# EasyEDA Pro project my_supercap_1.eprj, board 下板
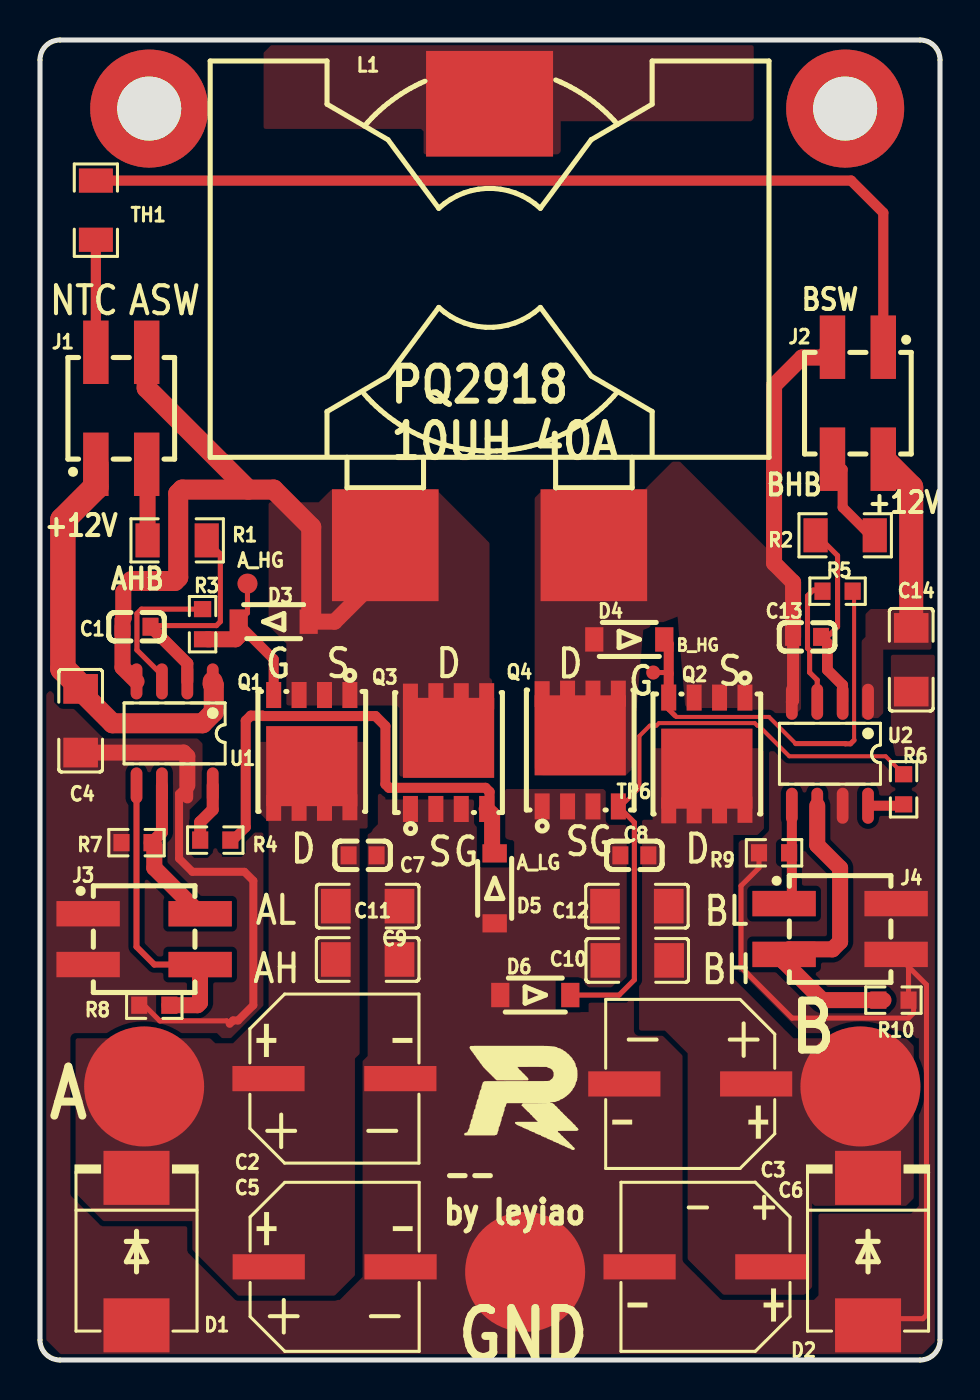
[diagram p10: board, top side]
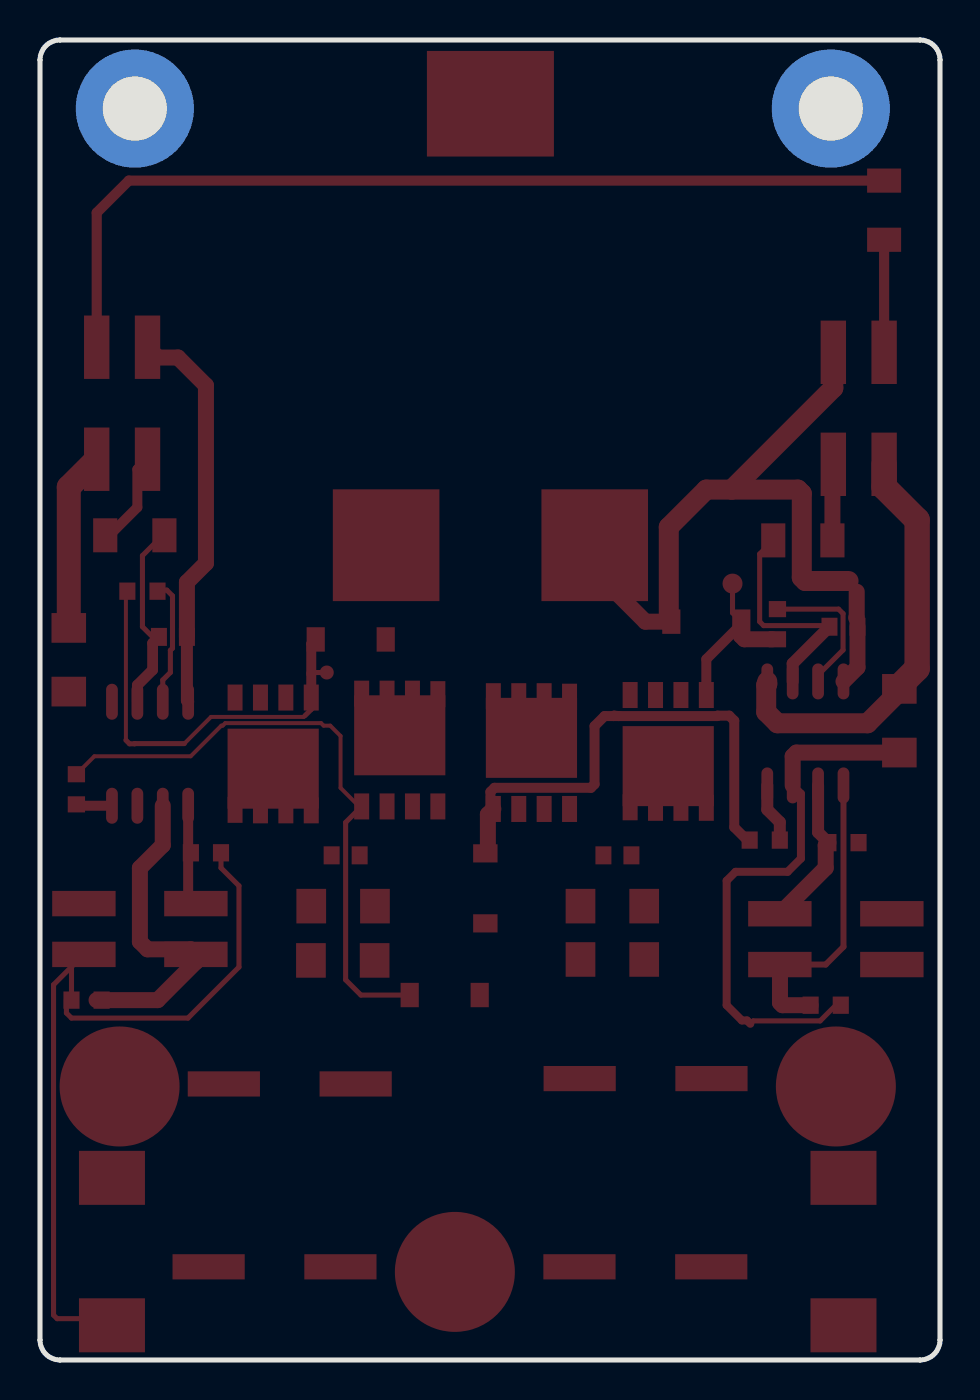
[diagram p11: board, bottom side, seen from below]

Outline 45 x 66 mm; copper layers: Top Layer, Bottom Layer. Coordinates in mm from the lower left corner of the outline.
Outline path: 0,65 0,1 arc(0.29,0.29) 1,0 44,0 arc(44.71,0.29) 45,1 45,65 arc(44.71,65.71) 44,66 1,66 arc(0.29,65.71) 0,65
Stack: Top Layer 0.035mm / Dielectric1 1.51mm FR4 er 4.5 / Bottom Layer 0.035mm

## Design rules (mm)
template: 自定义配置
spacing copperThickness1oz (default): track to track 0.102, other pairs 0.152 to 0.3
spacing copperThickness2oz: track to track 0.203, other pairs 0.152 to 0.3
track width copperThickness1oz (default): min 0.127, default 0.254, max 2.54
track width copperThickness2oz: min 0.203, default 0.254, max 2.54
differential pair differentialPair (default): width min 0.127, default 0.254, max 2.54; gap min 0.152, default 0.152
via viaSize (default): diameter min 0.5, default 0.61, max 10; hole min 0.3, default 0.305, max 6.3
net +12V uses copperRegion1
net GND uses copperRegion1
net GND1 uses copperRegion1
net A_SW uses copperRegion1
net A_POWER uses copperRegion1
net B_POWER uses copperRegion1
net B_SW uses copperRegion1

## Placement (name value [footprint] x y rotation side)
A_HG  -  [Test-Point-0.5mm#2]  10.37 38.82 0 top
A_LG  -  [Test-Point-0.5mm#3]  22.68 25.36 0 top
B_HG  -  [Test-Point-0.5mm]  30.66 34.37 0 top
C1  10uF  [C0603]  4.83 36.66 0 top
C2  220uF  [CAP-SMD_BD8.0-L8.3-W8.3-LS9.0-FD]  14.72 14.07 0 top
C3  220uF  [CAP-SMD_BD8.0-L8.3-W8.3-LS9.0-FD]  32.51 13.8 180 top
C4  10uF  [C1206]  2.03 31.96 90 top
C5  220uF  [CAP-SMD_BD8.0-L8.3-W8.3-LS9.0-FD]  14.73 4.66 0 top
C6  220uF  [CAP-SMD_BD8.0-L8.3-W8.3-LS9.0-FD]  33.27 4.66 180 top
C7  100nF  [C0603]  16.13 25.23 180 top
C8  100nF  [C0603]  29.72 25.23 180 top
C9  10uF  [C1206]  16.38 20.03 180 top
C10  10uF  [C1206]  29.86 19.98 180 top
C11  10uF  [C1206]  16.38 22.69 180 top
C12  10uF  [C1206]  29.84 22.69 180 top
C13  10uF  [C0603]  38.35 36.16 0 top
C14  10uF  [C1206]  43.56 35.01 90 top
D1  SMCJ28A  [SMC_L6.9-W5.9-LS7.9-RD]  4.83 5.42 270 top
D2  SMCJ28A  [SMC_L6.9-W5.9-LS7.9-RD]  41.4 5.42 270 top
D3  SMF10A  [SOD-123FL_L3.0-W1.8-LS3.7-R-RD]  11.68 36.92 0 top
D4  SMF10A  [SOD-123FL_L3.0-W1.8-LS3.7-R-RD]  29.46 36.03 180 top
D5  SMF10A  [SOD-123FL_L3.0-W1.8-LS3.7-R-RD]  22.73 23.58 270 top
D6  SMF10A  [SOD-123FL_L3.0-W1.8-LS3.7-R-RD]  24.76 18.25 180 top
J1  HX PZ2.54-2x2P TP  [HDR-SMD_4P-P2.54-V-M-R2-C2-LS7.5]  4.06 47.58 0 top
J2  HX PZ2.54-2x2P TP  [HDR-SMD_4P-P2.54-V-M-R2-C2-LS7.5]  40.89 47.84 180 top
J3  HX PZ2.54-2x2P TP  [HDR-SMD_4P-P2.54-V-M-R2-C2-LS7.5]  5.21 21.04 270 top
J4  HX PZ2.54-2x2P TP  [HDR-SMD_4P-P2.54-V-M-R2-C2-LS7.5]  40 21.55 270 top
L1  10uH 40A  [IND-SMD_3P-L27.9-W19.7-P10.43-LS27.9-BL-A]  22.48 51.78 0 top
NOREF  -  [Pad_e48]  24.26 4.41 0 top
NOREF#2  -  [Pad_e948]  5.46 62.57 0 top
NOREF#3  -  [Pad_e1]  5.21 13.68 0 top
NOREF#4  -  [Pad_e950]  40.26 62.57 0 top
NOREF#5  -  [Pad_e47]  41.02 13.68 0 top
Q1  BSC070N10NS3G  [PG-TDSON-8_L5.0-W6.0-P1.27-BL-EP]  13.59 30.43 180 top
Q2  BSC070N10NS3G  [PG-TDSON-8_L5.0-W6.0-P1.27-BL-EP]  33.34 30.3 180 top
Q3  BSC070N10NS3G  [PG-TDSON-8_L5.0-W6.0-P1.27-BL-EP]  20.43 30.37 0 top
Q4  BSC070N10NS3G  [PG-TDSON-8_L5.0-W6.0-P1.27-BL-EP]  27.01 30.5 0 top
R1  120Ω  [R1206]  6.86 40.98 0 top
R2  120Ω  [R1206]  40.26 41.23 180 top
R3  3.3Ω  [R0603]  8.13 36.79 90 top
R4  3.3Ω  [R0603]  8.76 26 0 top
R5  3.3Ω  [R0603]  39.88 38.44 180 top
R6  3.3Ω  [R0603]  43.18 28.53 90 top
R7  10kΩ  [R0603]  4.83 25.87 180 top
R8  10kΩ  [R0603]  5.72 17.74 180 top
R9  10kΩ  [R0603]  36.7 25.36 180 top
R10  10kΩ  [R0603]  42.67 17.99 0 top
TH1  B57621C5103J062  [R1206]  2.79 57.49 90 top
TP6  -  [Test-Point-0.5mm#3]  29 27.64 0 top
U1  UCC27201ADR  [SOIC-8_L4.9-W3.9-P1.27-LS6.0-BL]  6.73 31.33 180 top
U2  UCC27201ADR  [SOIC-8_L4.9-W3.9-P1.27-LS6.0-BL]  39.5 30.31 180 top

## Footprints (pads in the part's own frame, mm; a bottom-side part is the same pattern mirrored in y, then rotated)
C0603
  rect 0.8x0.9 smd: 1(-0.7,0) 2(0.7,0)
C1206
  rect 1.485x1.728 smd: 1(-1.593,0) 2(1.593,0)
CAP-SMD_BD8.0-L8.3-W8.3-LS9.0-FD
  rect 3.61x1.26 smd: 1(-3.295,0) 2(3.295,0)
HDR-SMD_4P-P2.54-V-M-R2-C2-LS7.5
  rect 1.27x3.17 smd: 1(-1.27,-2.8) 2(-1.27,2.8) 3(1.27,-2.8) 4(1.27,2.8)
IND-SMD_3P-L27.9-W19.7-P10.43-LS27.9-BL-A
  rect 5.33x5.59 smd: 1(-5.215,-11.037) 2(5.215,-11.037)
  rect 6.35x5.28 smd: 3(0,11.037)
Pad_e1
  round 6 smd: 1(0,0)
Pad_e47
  round 6 smd: 1(0,0)
Pad_e48
  round 6 smd: 1(0,0)
Pad_e948
  round 5.9 hole 3.2: 1(0,0)
Pad_e950
  round 5.9 hole 3.2: 1(0,0)
PG-TDSON-8_L5.0-W6.0-P1.27-BL-EP
  rect 0.75x1.3 smd: 1(-1.905,-2.82) 2(-0.635,-2.82) 3(0.635,-2.82) 4(1.905,-2.82) 5(1.905,2.82) 6(0.635,2.82) 7(-0.635,2.82) 8(-1.905,2.794)
  rect 4.56x4 smd: 8(0,0.737)
R0603
  rect 0.806x0.864 smd: 1(-0.753,0) 2(0.753,0)
R1206
  rect 1.208x1.701 smd: 1(-1.479,0) 2(1.479,0)
SMC_L6.9-W5.9-LS7.9-RD
  rect 2.7x3.3 smd: 1(-3.687,0) 2(3.687,0)
SOD-123FL_L3.0-W1.8-LS3.7-R-RD
  rect 0.909x1.219 smd: 1(1.75,0) 2(-1.75,0)
SOIC-8_L4.9-W3.9-P1.27-LS6.0-BL
  oval 0.588x1.8 smd: 1(-1.905,-2.6) 2(-0.635,-2.6) 3(0.635,-2.6) 4(1.905,-2.6) 5(1.905,2.6) 6(0.635,2.6) 7(-0.635,2.6) 8(-1.905,2.6)
Test-Point-0.5mm
  round 0.7 smd: 1(0,0)
Test-Point-0.5mm#2
  round 1 smd: 1(0,0)
Test-Point-0.5mm#3
  round 0.5 smd: 1(0,0)

## Nets
+12V: C4.2 C14.2 J1.1 J2.2 U1.1 U2.1
GND: C2.2 C3.2 C4.1 C5.2 C6.2 C7.1 C8.2 C9.1 C10.2 C11.1 C12.2 C14.1 D1.2 D2.2 D5.1 D6.1 J3.1 J3.3 J4.2 J4.4 NOREF.1 Q3.1 Q3.2 Q3.3 Q4.1 Q4.2 Q4.3 R7.2 R8.2 R9.2 R10.2 U1.7 U2.7
GND1: L1.3
GND2: J2.1 TH1.2
A_HB: J1.3 R1.1
A_HG: A_HG.1 D3.2 Q1.4 R3.1
A_HI: J3.4 R8.1 U1.5
A_LG: A_LG.1 D5.2 Q3.4 R4.2
A_LI: J3.2 R7.1 U1.6
A_POWER: C2.1 C5.1 C7.2 C9.2 C11.2 D1.1 NOREF#3.1 Q1.5 Q1.6 Q1.7 Q1.8
A_SW: C1.1 D3.1 J1.4 L1.1 Q1.1 Q1.2 Q1.3 Q3.5 Q3.6 Q3.7 Q3.8 U1.4
B_HB: J2.4 R2.1
B_HG: B_HG.1 D4.2 Q2.4 R5.1
B_HI: J4.1 R9.1 U2.5
B_LG: D6.2 Q4.4 R6.2 TP6.1
B_LI: J4.3 R10.1 U2.6
B_POWER: C3.1 C6.1 C8.1 C10.1 C12.1 D2.1 NOREF#5.1 Q2.5 Q2.6 Q2.7 Q2.8
B_SW: C13.1 D4.1 J2.3 L1.2 Q2.1 Q2.2 Q2.3 Q4.5 Q4.6 Q4.7 Q4.8 U2.4
NTC: J1.2 TH1.1
$3N434: R4.1 U1.8
$3N504: R3.2 U1.3
$3N611: C1.2 R1.2 U1.2
$3N1021: R6.1 U2.8
$3N1030: R5.2 U2.3
$3N1032: C13.2 R2.2 U2.2

Pads without a net: NOREF#2 1; NOREF#4 1

## Routing (per net, layer and track width the routed paths; a pad name or vN(x,y) marks a point on that pad's centre or on a via; arc(x,y) is an arc through that point)
+12V: length 30.4
  Top Layer w1: U1.1 8.64,33.8 8.69,33.75 8.69,32.4 8.13,31.84 3.62,31.84 2.03,33.43 C4.2
  Top Layer w1.2: C14.2 43.56,43.64 J2.2
  Top Layer w1.27: 2.03,33.68 1.14,34.57 1.14,42 2.79,43.65 J1.1
GND: length 67.2
  Top Layer w0.254: 43.68,17.99 43.68,17.35 43.43,17.1 37.6,17.1 35.05,19.64 35.05,23.71 35.95,24.61 R9.2 ; R10.2 43.43,19.66 ; 43.43,19.66 J4.4 ; 43.43,19.66 44.32,18.76 44.32,2.25 44.14,2.07 41.71,2.07 41.66,2.12 ; R8.2 5.21,17.74 5.99,16.95 9.34,16.95 9.48,16.81
  Top Layer w0.4: U1.7 6.95,28.32 6.95,25.07 7.62,24.41 10.22,24.41 10.67,23.96 10.67,17.74 9.91,16.98 9.65,16.98 9.48,16.81
  Top Layer w0.8: U1.7 7.37,30.19 7.18,30.37 C4.1
GND2: length 46.8
  Top Layer w0.508: J2.1 42.16,57.36 40.56,58.97 TH1.2
A_HB: length 3.8
  Top Layer w0.8: R1.1 5.38,44.74 J1.3
A_HG: length 8.5
  Top Layer w0.254: D3.2 10.37,37.36 A_HG.1
  Top Layer w0.5: 9.96,36.77 11.68,35.04 11.68,33.25
  Top Layer w0.8: 9.96,36.77 9.96,36.22 9.78,36.04 8.38,36.04
A_HI: length 15.1
  Top Layer w0.3: U1.5 4.83,20.66 5.72,19.77 J3.4
  Top Layer w0.8: R8.1 7.87,17.74 8,17.87 8,19.77 J3.4
A_LG: length 25.2
  Top Layer w0.5: R4.2 9.64,26 10.29,26.64 10.29,31.96 10.54,32.22 11.12,32.22 11.14,32.2 16.06,32.2 ; 16.32,32.2 16.3,32.22 16.06,32.2 ; 16.32,32.2 16.06,32.2 ; 16.32,32.2 16.77,32.2 17.27,31.7 17.27,28.79 17.45,28.61 22.28,28.61 22.48,28.41 22.48,27.57 22.46,27.55 Q3.4
  Top Layer w0.8: 22.61,25.71 22.61,27.28 Q3.4
A_LI: length 7.6
  Top Layer w0.6: R7.1 6.1,26.38 U1.6
  Top Layer w0.8: J3.2 5.72,24.6 5.72,25.73 R7.1
A_SW: length 38.2
  Top Layer w0.8: 4.19,37.11 4.16,37.11 4.16,38.41 ; C1.1 4.13,34.63 U1.4 ; L1.1 17.26,39.45 14.73,36.92 13.56,36.92
  Top Layer w1: 4.57,38.95 6.73,38.95 6.91,39.13 6.91,43.32 7.11,43.52 10.41,43.52 ; 13.56,36.92 13.56,41.64 11.68,43.52 10.41,43.52 ; 10.41,43.52 5.33,48.6 J1.4
B_HB: length 4.8
  Top Layer w0.5: J2.4 40.13,44.53 40.13,42.63 41.53,41.23 R2.1
B_HG: length 21.9
  Top Layer w0.2: 40.71,30.99 40.71,38.37 ; 37.78,30.82 36.45,32.15 31.81,32.15 31.75,32.22
  Top Layer w0.254: 40.71,38.37 R5.1 ; B_HG.1 31.38,34.37 31.44,34.32 ; 37.78,30.82 40.26,30.82 40.27,30.81 40.52,30.81 40.71,30.99 ; 31.75,32.22 31.44,32.53 Q2.4
  Top Layer w0.5: Q2.4 31.44,35.81 D4.2
B_HI: length 5.1
  Top Layer w0.5: 37.59,27.71 37.59,23.21 J4.1
B_LG: length 31.1
  Top Layer w0.2: Q4.4 29.04,27.68 29.97,28.61 29.97,31.2 30.49,31.72 30.82,31.72 30.95,31.84 35.74,31.84 35.87,31.72 35.93,31.72 37.47,30.19 42.28,30.19 R6.2
  Top Layer w0.254: Q4.4 29.72,26.88 29.72,19.01 28.96,18.25 D6.2
B_LI: length 16.5
  Top Layer w0.8: 38.86,27.71 38.86,25.74 40,24.6 40,20.92 39.62,20.53 37.46,20.53 J4.3 37.21,19.91 39.12,17.99 42.17,17.99
B_SW: length 19.9
  Top Layer w0.6: C13.1 37.65,32.97 U2.4
  Top Layer w0.8: C13.1 37.65,38.89 36.7,39.84 36.7,48.73 38.1,50.12 39.11,50.12 J2.3
NTC: length 5.6
  Top Layer w0.508: J1.2 TH1.1
$3N434: length 3
  Top Layer w0.6: R4.1 8.01,26.89 8.64,27.52 U1.8
$3N504: length 7.3
  Top Layer w0.254: R3.2 5.07,37.54 4.85,37.32 4.85,35.5 6.1,34.25 U1.3
$3N611: length 11.4
  Top Layer w0.254: 8.34,40.98 9.02,40.3 9.02,36.92 8.82,36.72 5.58,36.72 C1.2
  Top Layer w0.6: U1.2 7.37,34.82 C1.2
$3N1021: length 1.8
  Top Layer w0.5: 41.4,27.71 43.11,27.71 R6.1
$3N1030: length 6.4
  Top Layer w0.254: U2.3 38.86,34 38.48,34.38 38.48,35.48 38.38,35.59 38.38,38.21 38.66,38.49 39.07,38.49 R5.2
$3N1032: length 9.8
  Top Layer w0.254: C13.2 39.37,36.16 39.88,36.66 39.88,40.22 38.86,41.23 R2.2
  Top Layer w0.54: U2.2 40.13,33.74 39.37,34.5 39.37,35.84 C13.2

## Copper pours and planes (outline as drawn; the poured copper is in the pictures)
+12V on Top Layer: 41.53,37.55 44.45,37.55 44.58,37.42 44.58,35.52 42.54,35.52 42.54,35.52 42.16,35.52 42.16,32.34 41.91,32.09 41.08,32.09 41.08,35.96 41.28,36.16 41.28,37.3
GND on Top Layer: 42.55,35.27 44.96,35.27 44.96,1.12 44.13,0.29 1.02,0.29 0.31,1 0.31,33.29 0.51,33.49 0.7,33.29 0.7,32.89 0.99,32.6 1.65,32.6 3.18,31.08 7.87,31.08 8.13,30.82 8.13,28.15 7.48,27.51 7.48,25.33 7.71,25.11 8.38,25.11 8.64,25.36 8.64,26 9.09,26 9.09,25.16 10.09,25.16 10.29,25.36 10.29,26 10.67,26.38 11.43,26.38 11.43,17.74 9.65,15.96 9.23,15.96 8.85,16.34 1.91,16.34 1.62,16.06 1.62,8.22 3.15,6.69 7.62,6.69 7.62,6.69 7.62,5.29 9.91,3.01 14.99,3.01 16.13,4.15 16.13,14.95 16.38,15.2 16.38,26.28 16.89,26.79 16.89,28.28 16.64,28.54 16.76,28.66 16.89,28.66 17.27,28.28 17.27,28.03 21.84,28.03 21.84,24.87 22.01,24.7 23.71,24.7 23.71,25.91 23.62,26 23.39,26 23.25,26.14 23.25,28.55 28.18,28.55 28.32,28.41 28.32,26.88 28.45,26.76 29.34,26.76 29.46,26.63 29.46,19.14 29.21,18.88 28.83,18.88 28.58,18.63 27.43,18.63 26.92,19.14 25.91,19.14 25.78,19.01 25.78,17.49 25.91,17.36 25.95,17.4 27.43,17.4 27.43,17.74 27.31,17.87 29.34,17.87 29.85,18.38 29.85,16.47 30.1,16.22 31.37,16.22 32.26,15.33 32.26,4.95 34.2,3.01 38.7,3.01 38.92,3.23 38.92,7.26 38.99,7.33 43.56,7.33 43.94,7.71 43.94,16.09 43.82,16.09 43.56,16.34 43.18,16.34 43.05,16.47 40.39,16.47 40.26,16.34 38.1,16.34 35.05,19.39 34.93,19.39 34.93,25.87 35.05,26 35.94,26 36.45,26.5 36.45,30.44 36.83,30.44 37.34,29.93 42.08,29.93 42.65,29.37 42.65,28.75 43.78,28.75 43.97,28.94 43.97,30.19 42.77,30.19 42.55,31.35
GND1 on Top Layer: 11.18,65.36 11.18,61.56 19.05,61.56 19.18,61.43 19.18,60.28 25.91,60.28 26.03,60.41 26.03,61.94 35.56,61.94 35.69,62.06 35.69,65.75 11.56,65.75
A_POWER on Top Layer: 10.9,30.91 16.3,30.91 16.38,30.82 16.38,26.57 15.98,26.57 15.98,15.3 15.75,15.07 15.75,4.23 14.73,3.22 9.91,3.22 7.62,5.51 7.62,6.94 3.18,6.94 1.78,8.34 1.78,16.09 8.51,16.09 8.76,15.83 9.65,15.83 11.43,17.61 11.43,26.9 10.9,27.43
A_SW on Top Layer: 11.43,42.89 11.43,36.71 12.32,35.83 12.32,32.73 17.84,32.73 17.97,32.6 17.97,29.24 18.03,29.17 22.61,29.17 22.61,34 22.48,34.12 22.48,40.85 19.81,43.52 14.57,43.52 13.94,42.89
B_POWER on Top Layer: 36.04,30.59 36.19,30.44 36.19,26.57 35.88,26.25 34.67,26.25 34.67,19.08 37.67,16.09 43.31,16.09 43.69,15.71 43.69,8.09 43.31,7.71 38.74,7.71 38.61,7.83 38.61,3.64 38.23,3.26 34.16,3.26 32.38,5.04 32.38,15.33 31.24,16.47 29.95,16.47 29.95,27.01 30.63,27.01 30.63,30.59
B_SW on Top Layer: 25.15,43.52 30.23,43.52 31.62,44.92 32,44.92 38.03,38.89 38.05,38.89 38.05,32.55 37.85,32.34 35.81,32.34 35.56,32.6 32.38,32.6 32.26,32.73 31.88,37.17 30.16,36.5 29.57,29.52 29.29,29.23 25.07,29.23 24.73,29.57 24.73,43.11

## Text on the board
Top Silkscreen Layer: +12V | AHB | BHB | BSW | -- / by leyiao | AH | AL | G | D | S | BH | BL | +  - | NTC | ASW | PQ2918 / 10UH 40A | A | GND | B
